# EAGLE design HP32W_grove (EAGLE 7.2.0)
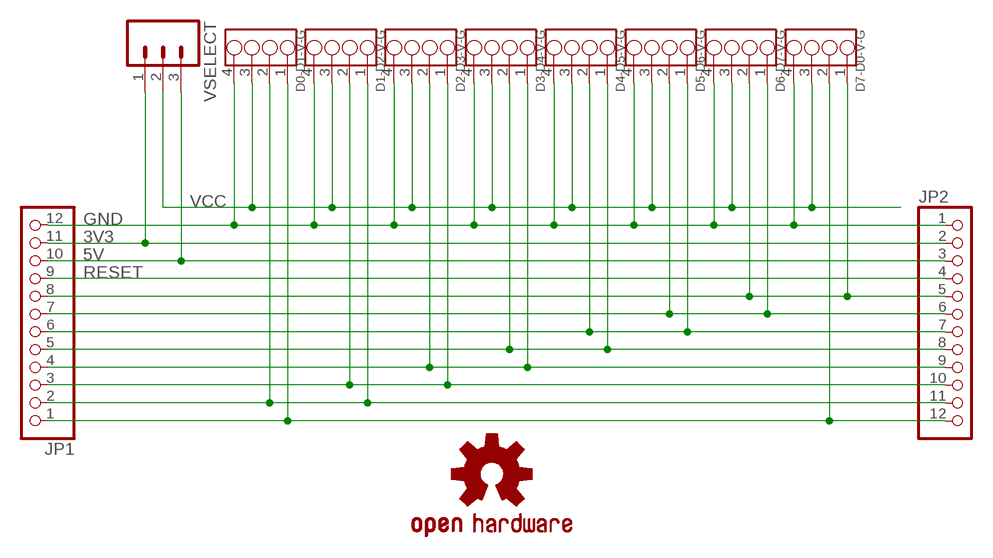
[diagram p0: schematic, sheet 1]

## Parts
D0-D1-V-G  GROVE-4P-2.0-3470130P1  [4P-2.0]
D1-D2-V-G  GROVE-4P-2.0-3470130P1  [4P-2.0]
D2-D3-V-G  GROVE-4P-2.0-3470130P1  [4P-2.0]
D3-D4-V-G  GROVE-4P-2.0-3470130P1  [4P-2.0]
D4-D5-V-G  GROVE-4P-2.0-3470130P1  [4P-2.0]
D5-D6-V-G  GROVE-4P-2.0-3470130P1  [4P-2.0]
D6-D7-V-G  GROVE-4P-2.0-3470130P1  [4P-2.0]
D7-D0-V-G  GROVE-4P-2.0-3470130P1  [4P-2.0]
JP1  PINHD-1X12-CB  [1X12-CB]
JP2  PINHD-1X12-CB  [1X12-CB]
LOGO1  OSHW-LOGOS  [OSHW-LOGO-S]
VSELECT  M03PTH  [1X03]

## Nets
3V3: JP1.11 JP2.2 VSELECT.1
5V: JP1.10 JP2.3 VSELECT.3
GND: D0-D1-V-G.4 D1-D2-V-G.4 D2-D3-V-G.4 D3-D4-V-G.4 D4-D5-V-G.4 D5-D6-V-G.4 D6-D7-V-G.4 D7-D0-V-G.4 JP1.12 JP2.1
N$1: D6-D7-V-G.2 D7-D0-V-G.1 JP1.8 JP2.5
N$2: D5-D6-V-G.2 D6-D7-V-G.1 JP1.7 JP2.6
N$3: D4-D5-V-G.2 D5-D6-V-G.1 JP1.6 JP2.7
N$4: D3-D4-V-G.2 D4-D5-V-G.1 JP1.5 JP2.8
N$5: D2-D3-V-G.2 D3-D4-V-G.1 JP1.4 JP2.9
N$6: D1-D2-V-G.2 D2-D3-V-G.1 JP1.3 JP2.10
N$7: D0-D1-V-G.2 D1-D2-V-G.1 JP1.2 JP2.11
N$8: D0-D1-V-G.1 D7-D0-V-G.2 JP1.1 JP2.12
RESET: JP1.9 JP2.4
VCC: D0-D1-V-G.3 D1-D2-V-G.3 D2-D3-V-G.3 D3-D4-V-G.3 D4-D5-V-G.3 D5-D6-V-G.3 D6-D7-V-G.3 D7-D0-V-G.3 VSELECT.2

## Library data of the parts
D0-D1-V-G D1-D2-V-G D2-D3-V-G D3-D4-V-G D4-D5-V-G D5-D6-V-G D6-D7-V-G D7-D0-V-G = Connector:GROVE-4P-2.0
JP1 JP2 = adafruit:PINHD-1X12: PIN HEADER
LOGO1 = SparkFun-Aesthetics:OSHW-LOGO: Open Source Hardware Logo This logo indicates the piece of hardware it is found on incorporates a OSHW license and/or adheres to the definition of open source hardware found here: http://freedomdefined.org/OSHW
VSELECT = SparkFun-Connectors:M03: Header 3 Standard 3-pin 0.1" header. Use with straight break away headers (SKU : PRT-00116), right angle break away headers (PRT-00553), swiss pins (PRT-00743), machine pins (PRT-00117), and female headers (PRT-00115). Molex polarized connector foot print use with SKU : PRT-08232 with associated crimp pins and housings.

## Board
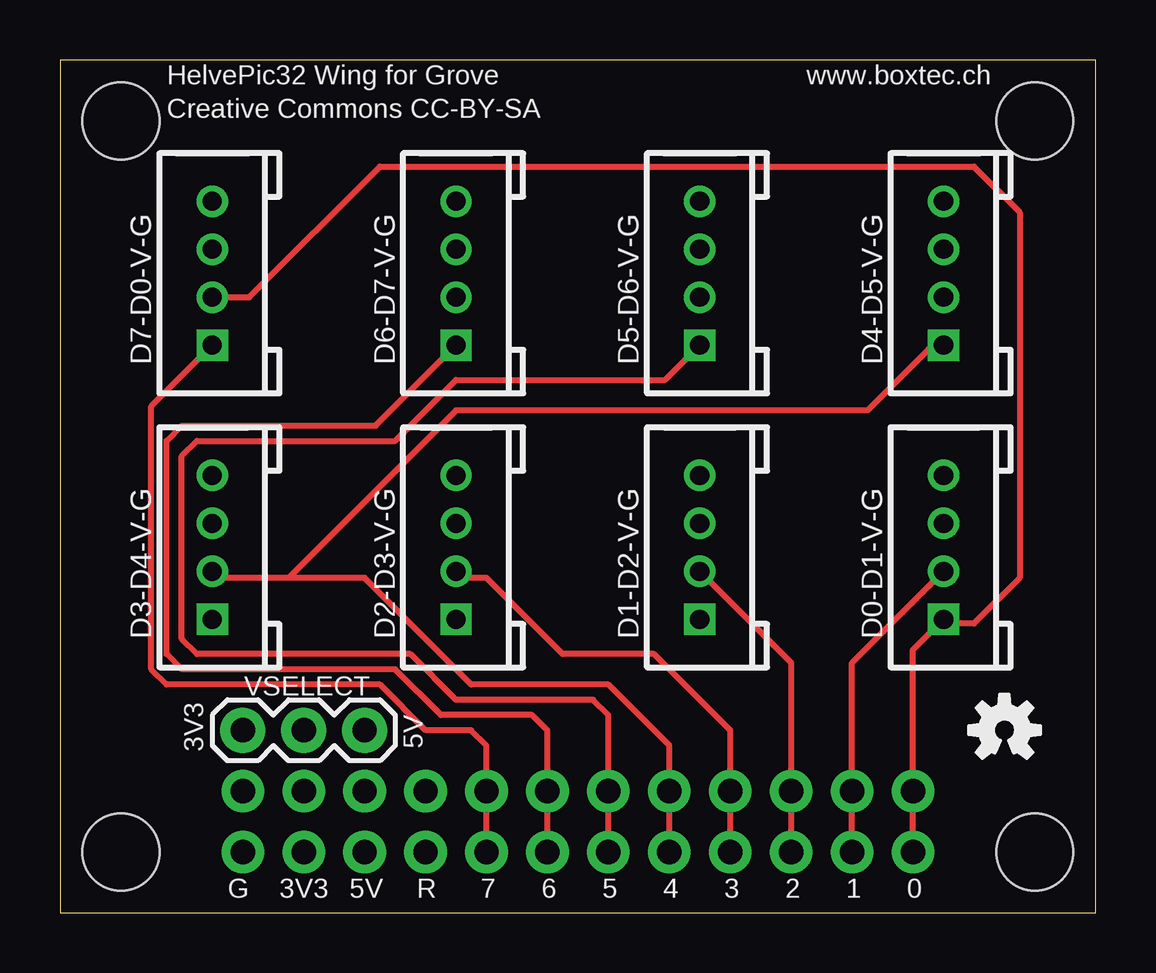
[diagram p1: board, top side]
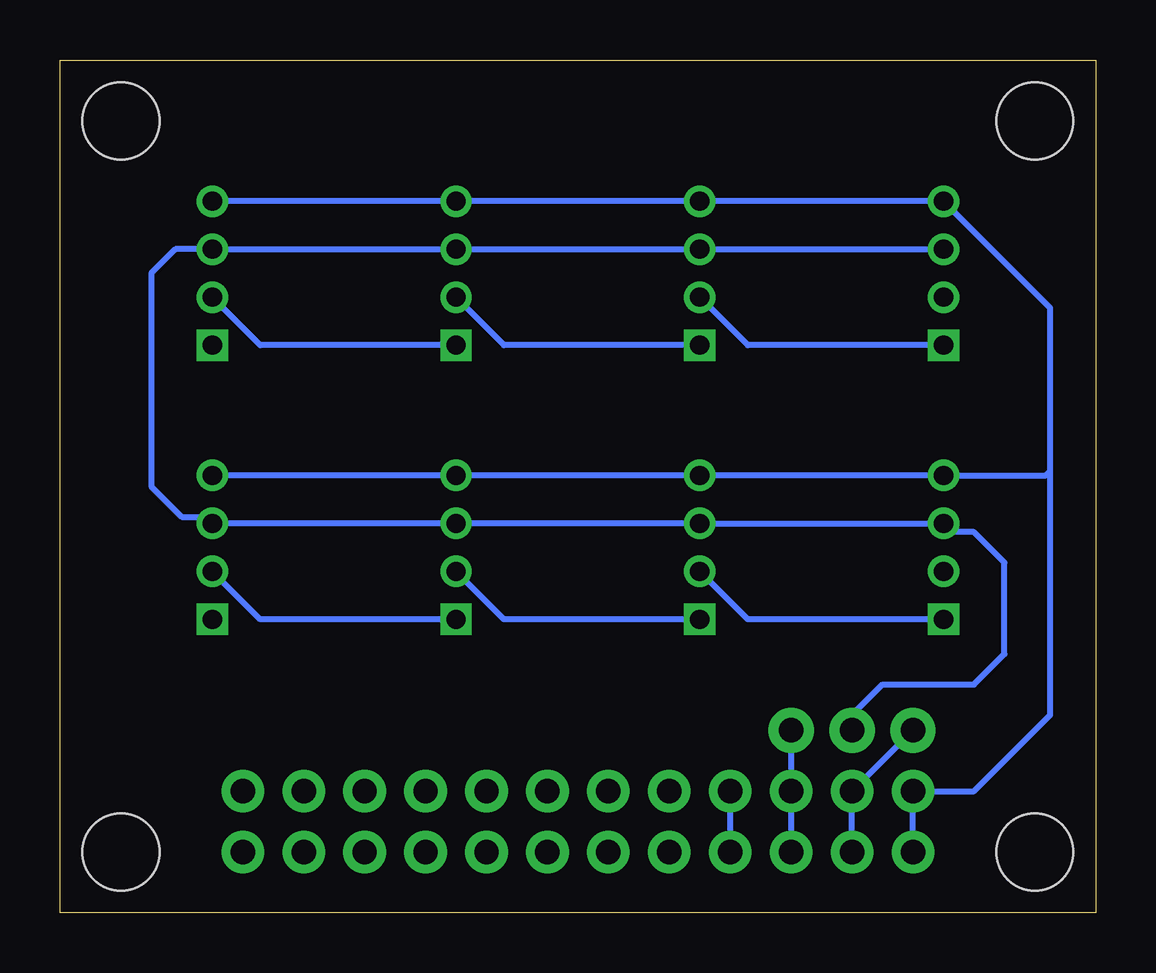
[diagram p2: board, bottom side, seen from below]

Size 43.18 x 35.56 mm. Coordinates in mm from the lower left corner, seen from the top.
Outline: 0,0 43.18,0 43.18,35.56 0,35.56 0,0
Copper layers (1*16): Top 0.035mm / dielectric 1.5mm / Bottom 0.035mm
Design rules "Elecrow_2-layer_eagle_rule": minimum track width 6mil, minimum drill 12mil, track to track 6mil, track to pad 6mil, pad to pad 6mil, via to via 6mil, smd to smd 0mil, copper to edge 10mil, drill to drill 10mil, minimum pad ring 10mil, minimum via ring 6mil, stop-mask expansion 2mil, vias tented up to drill 100mil, thermal gap 10mil
Holes 3.2 mm at 2.54,2.54 40.64,2.54 40.64,33.02 2.54,33.02

### Footprints (pad centres in the part's own frame; a part is rotated, then mirrored left to right if it is on the bottom)
4P-2.0 = drill 0.8 pad 1.27 square: 1 -3,0 | drill 0.8 pad 1.27: 2 -1,0; 3 1,0; 4 3,0
1X12-CB = drill 1.016 pad 1.778: 1 -13.97,0; 2 -11.43,0; 3 -8.89,0; 4 -6.35,0; 5 -3.81,0; 6 -1.27,0; 7 1.27,0; 8 3.81,0; 9 6.35,0; 10 8.89,0; 11 11.43,0; 12 13.97,0
1X03 = drill 1.016 pad 1.88: 1 0,0; 2 2.54,0; 3 5.08,0

### Placement (x,y rotation side)
D0-D1-V-G  36.83,15.24 90 top
D1-D2-V-G  26.67,15.24 90 top
D2-D3-V-G  16.51,15.24 90 top
D3-D4-V-G  6.35,15.24 90 top
D4-D5-V-G  36.83,26.67 90 top
D5-D6-V-G  26.67,26.67 90 top
D6-D7-V-G  16.51,26.67 90 top
D7-D0-V-G  6.35,26.67 90 top
JP1  21.59,2.54 180 top
JP2  21.59,5.08 0 top
LOGO1  39.37,7.62 0 top
VSELECT  7.62,7.62 0 top

### Tracks (layer width: path | path; a pad name or v marks a point on that pad's centre or on a via)
3V3
  Bottom 0.254: VSELECT.1 JP2.2 JP1.11
5V
  Bottom 0.254: VSELECT.3 JP2.3 JP1.10
GND
  Bottom 0.254: JP1.12 JP2.1 5.08,5.08 1.91,8.26 1.91,18.41 | 1.91,18.41 1.91,25.23 D7-D0-V-G.4 D6-D7-V-G.4 D5-D6-V-G.4 D4-D5-V-G.4 | 1.91,18.41 2.08,18.24 D3-D4-V-G.4 D2-D3-V-G.4 D1-D2-V-G.4 D0-D1-V-G.4
N$1
  Top 0.254: D7-D0-V-G.1 3.81,21.13 3.81,10.16 4.45,9.53 13.34,9.53 15.24,7.62 17.14,7.62 17.78,6.99 JP2.5 JP1.8
  Bottom 0.254: D7-D0-V-G.1 14.51,23.67 D6-D7-V-G.2
N$2
  Top 0.254: D6-D7-V-G.1 13.16,20.32 5.08,20.32 4.45,19.68 4.45,10.79 5.08,10.16 13.97,10.16 15.88,8.26 19.68,8.26 20.32,7.62 JP2.6 JP1.7
  Bottom 0.254: D6-D7-V-G.1 24.67,23.67 D5-D6-V-G.2
N$3
  Top 0.254: D5-D6-V-G.1 25.23,22.23 16.51,22.23 13.97,19.68 5.71,19.68 5.08,19.05 5.08,11.43 5.71,10.79 14.61,10.79 16.51,8.89 22.23,8.89 22.86,8.26 JP2.7 JP1.6
  Bottom 0.254: D5-D6-V-G.1 34.83,23.67 D4-D5-V-G.2
N$4
  Top 0.254: 9.53,13.97 12.7,13.97 17.14,9.53 22.86,9.53 25.4,6.99 JP2.8 JP1.5 | 9.53,13.97 6.62,13.97 D3-D4-V-G.2 | D4-D5-V-G.1 36.83,23.5 36.2,23.5 33.66,20.95 16.51,20.95 9.53,13.97
N$5
  Top 0.254: D2-D3-V-G.2 16.78,13.97 17.78,13.97 20.95,10.79 24.77,10.79 27.94,7.62 JP2.9 JP1.4
  Bottom 0.254: D3-D4-V-G.1 14.51,12.24 D2-D3-V-G.2
N$6
  Top 0.254: D1-D2-V-G.2 30.48,10.43 JP2.10 JP1.3
  Bottom 0.254: D2-D3-V-G.1 24.67,12.24 D1-D2-V-G.2
N$7
  Top 0.254: D0-D1-V-G.2 33.02,10.43 JP2.11 JP1.2
  Bottom 0.254: D1-D2-V-G.1 34.83,12.24 D0-D1-V-G.2
N$8
  Top 0.254: D7-D0-V-G.2 7.89,25.67 13.34,31.11 38.1,31.11 40.01,29.21 40.01,13.97 38.1,12.06 37.01,12.06 D0-D1-V-G.1 35.56,10.97 JP2.12 JP1.1
RESET
  Bottom 0.254: JP1.9 JP2.4
VCC
  Bottom 0.254: D7-D0-V-G.3 D6-D7-V-G.3 D5-D6-V-G.3 D4-D5-V-G.3 38.37,27.67 39.37,26.67 39.37,17.78 38.1,16.51 37.1,16.51 D0-D1-V-G.3 D1-D2-V-G.3 D2-D3-V-G.3 D3-D4-V-G.3 5.99,15.88 5.08,15.88 3.81,14.61 3.81,10.79 5.08,9.53 8.89,9.53 10.16,8.26 VSELECT.2

### Text on the board
tNames: HelvePic32 Wing for Grove | www.boxtec.ch | Creative Commons CC-BY-SA | 3V3 | 5V | G | 3V3 | 5V | R | 7 | 6 | 5 | 4 | 3 | 2 | 1 | 0